# Altium schematic sheet Nghich.SchDoc
size A
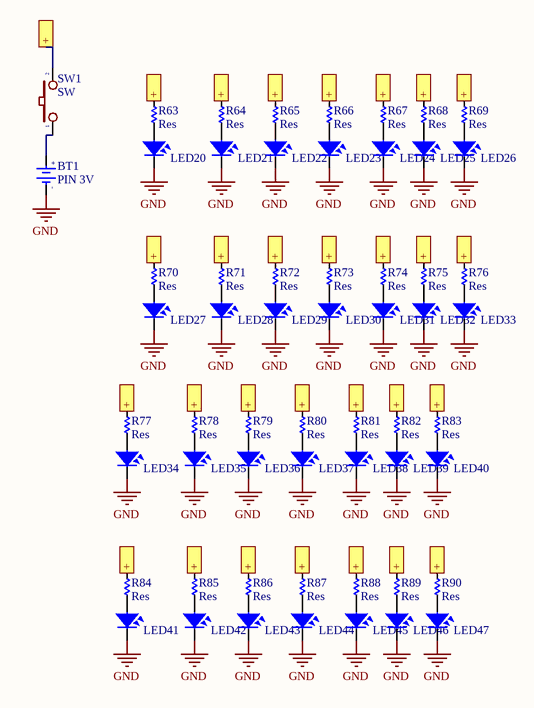
[diagram p0: Nghich.SchDoc]

## Parts
BT1  PIN 3V  [PIN3V]
LED20  LED  [LED-0805-Blue]  (value not drawn)
LED21  LED  [LED-0805-Blue]  (value not drawn)
LED22  LED  [LED-0805-Blue]  (value not drawn)
LED23  LED  [LED-0805-Blue]  (value not drawn)
LED24  LED  [LED-0805-Blue]  (value not drawn)
LED25  LED  [LED-0805-Blue]  (value not drawn)
LED26  LED  [LED-0805-Blue]  (value not drawn)
LED27  LED  [LED-0805-Blue]  (value not drawn)
LED28  LED  [LED-0805-Blue]  (value not drawn)
LED29  LED  [LED-0805-Blue]  (value not drawn)
LED30  LED  [LED-0805-Blue]  (value not drawn)
LED31  LED  [LED-0805-Blue]  (value not drawn)
LED32  LED  [LED-0805-Blue]  (value not drawn)
LED33  LED  [LED-0805-Blue]  (value not drawn)
LED34  LED  [LED-0805-Blue]  (value not drawn)
LED35  LED  [LED-0805-Blue]  (value not drawn)
LED36  LED  [LED-0805-Blue]  (value not drawn)
LED37  LED  [LED-0805-Blue]  (value not drawn)
LED38  LED  [LED-0805-Blue]  (value not drawn)
LED39  LED  [LED-0805-Blue]  (value not drawn)
LED40  LED  [LED-0805-Blue]  (value not drawn)
LED41  LED  [LED-0805-Blue]  (value not drawn)
LED42  LED  [LED-0805-Blue]  (value not drawn)
LED43  LED  [LED-0805-Blue]  (value not drawn)
LED44  LED  [LED-0805-Blue]  (value not drawn)
LED45  LED  [LED-0805-Blue]  (value not drawn)
LED46  LED  [LED-0805-Blue]  (value not drawn)
LED47  LED  [LED-0805-Blue]  (value not drawn)
R63  Res  [RES-SMD-0805]
R64  Res  [RES-SMD-0805]
R65  Res  [RES-SMD-0805]
R66  Res  [RES-SMD-0805]
R67  Res  [RES-SMD-0805]
R68  Res  [RES-SMD-0805]
R69  Res  [RES-SMD-0805]
R70  Res  [RES-SMD-0805]
R71  Res  [RES-SMD-0805]
R72  Res  [RES-SMD-0805]
R73  Res  [RES-SMD-0805]
R74  Res  [RES-SMD-0805]
R75  Res  [RES-SMD-0805]
R76  Res  [RES-SMD-0805]
R77  Res  [RES-SMD-0805]
R78  Res  [RES-SMD-0805]
R79  Res  [RES-SMD-0805]
R80  Res  [RES-SMD-0805]
R81  Res  [RES-SMD-0805]
R82  Res  [RES-SMD-0805]
R83  Res  [RES-SMD-0805]
R84  Res  [RES-SMD-0805]
R85  Res  [RES-SMD-0805]
R86  Res  [RES-SMD-0805]
R87  Res  [RES-SMD-0805]
R88  Res  [RES-SMD-0805]
R89  Res  [RES-SMD-0805]
R90  Res  [RES-SMD-0805]
SW1  SW  [SW-DIP1]

## Ports
+

## Nets
GND: BT1.2(GND) LED20.2 LED21.2 LED22.2 LED23.2 LED24.2 LED25.2 LED26.2 LED27.2 LED28.2 LED29.2 LED30.2 LED31.2 LED32.2 LED33.2 LED34.2 LED35.2 LED36.2 LED37.2 LED38.2 LED39.2 LED40.2 LED41.2 LED42.2 LED43.2 LED44.2 LED45.2 LED46.2 LED47.2
+: R63.1 R64.1 R65.1 R66.1 R67.1 R68.1 R69.1 R70.1 R71.1 R72.1 R73.1 R74.1 R75.1 R76.1 R77.1 R78.1 R79.1 R80.1 R81.1 R82.1 R83.1 R84.1 R85.1 R86.1 R87.1 R88.1 R89.1 R90.1 SW1.2 ; port +
NetBT1_1: BT1.1(+3V) SW1.1
NetLED20_1: LED20.1 R63.2
NetLED21_1: LED21.1 R64.2
NetLED22_1: LED22.1 R65.2
NetLED23_1: LED23.1 R66.2
NetLED24_1: LED24.1 R67.2
NetLED25_1: LED25.1 R68.2
NetLED26_1: LED26.1 R69.2
NetLED27_1: LED27.1 R70.2
NetLED28_1: LED28.1 R71.2
NetLED29_1: LED29.1 R72.2
NetLED30_1: LED30.1 R73.2
NetLED31_1: LED31.1 R74.2
NetLED32_1: LED32.1 R75.2
NetLED33_1: LED33.1 R76.2
NetLED34_1: LED34.1 R77.2
NetLED35_1: LED35.1 R78.2
NetLED36_1: LED36.1 R79.2
NetLED37_1: LED37.1 R80.2
NetLED38_1: LED38.1 R81.2
NetLED39_1: LED39.1 R82.2
NetLED40_1: LED40.1 R83.2
NetLED41_1: LED41.1 R84.2
NetLED42_1: LED42.1 R85.2
NetLED43_1: LED43.1 R86.2
NetLED44_1: LED44.1 R87.2
NetLED45_1: LED45.1 R88.2
NetLED46_1: LED46.1 R89.2
NetLED47_1: LED47.1 R90.2

## Notes on the sheet
- (in symbol PIN 3V) +; -

## Library data of the parts
BT1 = PIN 3V: Battery 3VDC; Value: PIN 3V
LED20-LED47 = LED SMD: Value: LED 3 - 5 ly 2 Colour
R63-R90 = Res-SMD: Resistor; Manufacturer: Generic Components; Class: Passive; Published: 08/06/2000; Publisher: Altium Hobart Technology Centre
SW1 = SW2: Switch button 2 pin; Value: SW chip 2 pin